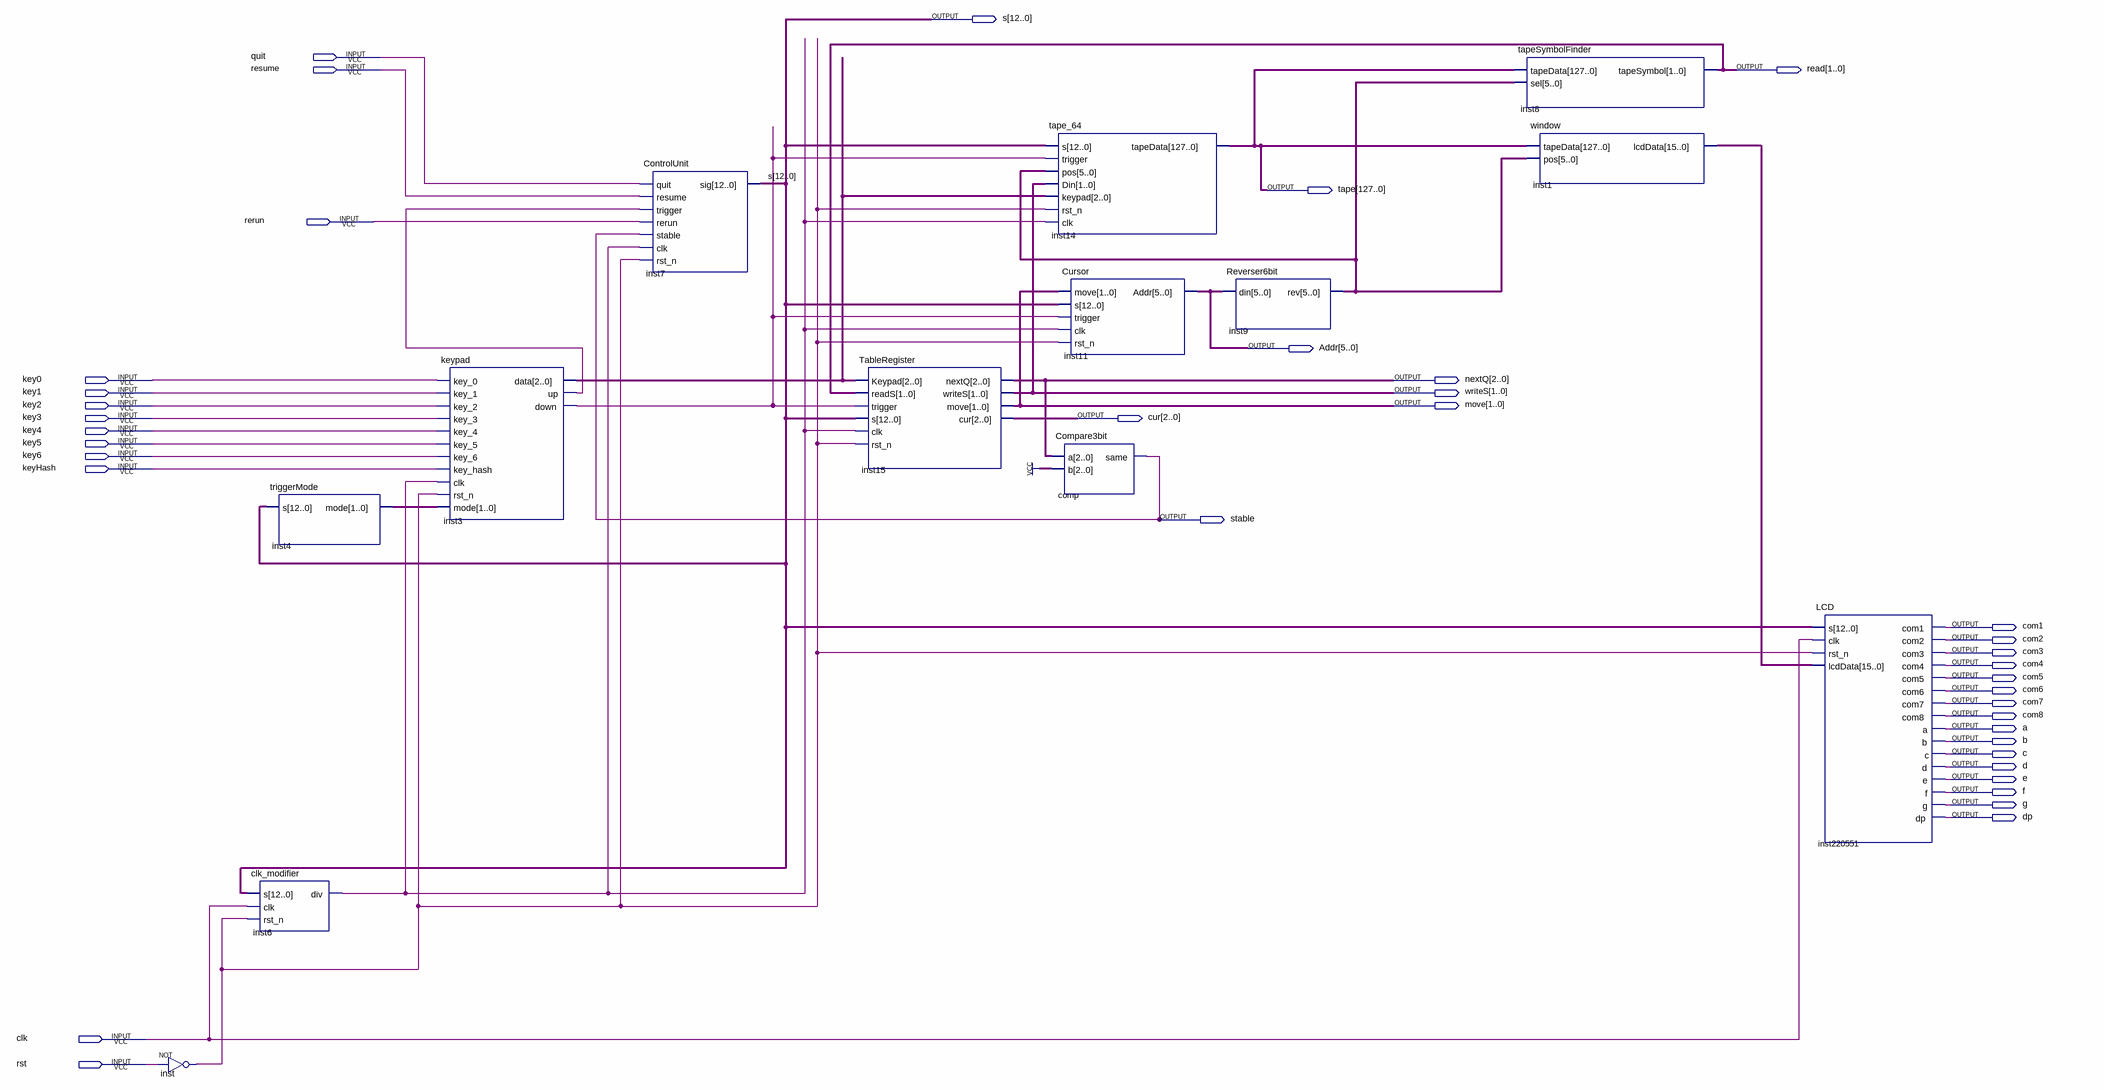
[diagram p0: schematic sheet]
// Quartus schematic TuringMachine_back.bdf as structural Verilog: 13 symbols, 38 pins
module TuringMachine_back (
  input  quit,
  input  resume,
  input  rerun,
  input  key0,
  input  key1,
  input  key2,
  input  key3,
  input  key4,
  input  key5,
  input  key6,
  input  keyHash,
  input  clk,
  input  rst,
  output [12:0] s,
  output [1:0] read,
  output [127:0] tape,
  output [5:0] Addr,
  output [2:0] nextQ,
  output [1:0] writeS,
  output [1:0] move,
  output [2:0] cur,
  output stable,
  output com1,
  output com2,
  output com3,
  output com4,
  output com5,
  output com6,
  output com7,
  output com8,
  output a,
  output b,
  output c,
  output d,
  output e,
  output f,
  output g,
  output dp
);

  wire inst3_down, inst3_up, inst6_div, inst_out;
  wire [1:0] inst4_mode;
  wire [2:0] inst3_data;
  wire [5:0] inst9_rev;
  wire [15:0] inst1_lcddata;

  not inst (inst_out, rst);
  triggerMode inst4 (.s(s), .mode(inst4_mode));
  clk_modifier inst6 (.s(s), .clk(clk), .rst_n(inst_out), .div(inst6_div));
  keypad inst3 (
    .key_0(key0), .key_1(key1), .key_2(key2), .key_3(key3), .key_4(key4), .key_5(key5), .key_6(key6),
    .key_hash(keyHash), .clk(inst6_div), .rst_n(inst_out), .mode(inst4_mode), .data(inst3_data),
    .up(inst3_up), .down(inst3_down));
  ControlUnit inst7 (
    .quit(quit), .resume(resume), .trigger(inst3_up), .rerun(rerun), .stable(stable), .clk(inst6_div),
    .rst_n(inst_out), .sig(s));
  TableRegister inst15 (
    .Keypad(inst3_data), .readS(read), .trigger(inst3_down), .s(s), .clk(inst6_div), .rst_n(inst_out),
    .nextQ(nextQ), .writeS(writeS), .move(move), .cur(cur));
  tape_64 inst14 (
    .s(s), .trigger(inst3_down), .pos(inst9_rev), .Din(writeS), .keypad(inst3_data), .rst_n(inst_out),
    .clk(inst6_div), .tapeData(tape));
  Cursor inst11 (.move(move), .s(s), .trigger(inst3_down), .clk(inst6_div), .rst_n(inst_out), .Addr(Addr));
  Compare3bit comp (.a(nextQ), .b(3'b111), .same(stable));
  Reverser6bit inst9 (.din(Addr), .rev(inst9_rev));
  tapeSymbolFinder inst8 (.tapeData(tape), .sel(inst9_rev), .tapeSymbol(read));
  window inst1 (.tapeData(tape), .pos(inst9_rev), .lcdData(inst1_lcddata));
  LCD inst220551 (
    .s(s), .clk(clk), .rst_n(inst_out), .lcdData(inst1_lcddata), .com1(com1), .com2(com2), .com3(com3),
    .com4(com4), .com5(com5), .com6(com6), .com7(com7), .com8(com8), .a(a), .b(b), .c(c), .d(d), .e(e),
    .f(f), .g(g), .dp(dp));
endmodule
